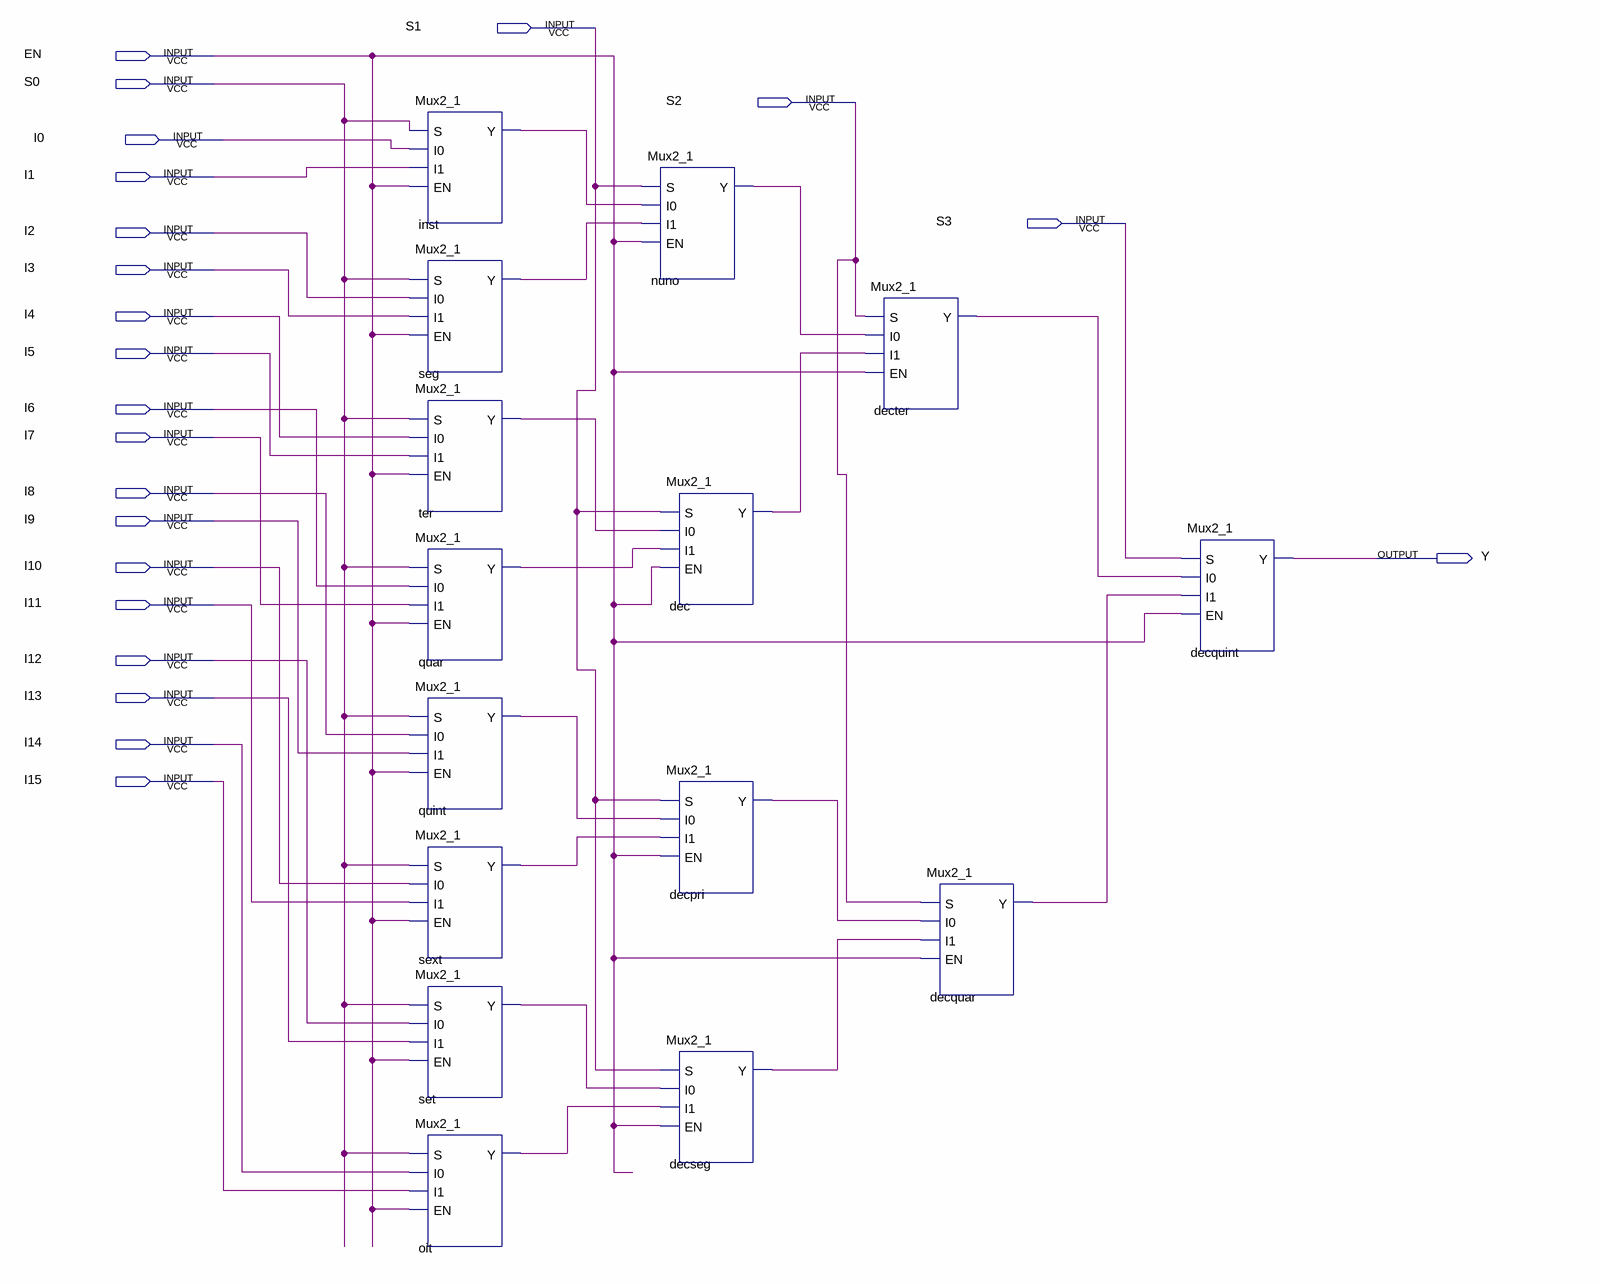
[diagram p0: schematic sheet]
// Quartus schematic Mux16_1.bdf as structural Verilog: 15 symbols, 22 pins
module Mux16_1 (
  input  S1,
  input  EN,
  input  S0,
  input  S2,
  input  I0,
  input  I1,
  input  S3,
  input  I2,
  input  I3,
  input  I4,
  input  I5,
  input  I6,
  input  I7,
  input  I8,
  input  I9,
  input  I10,
  input  I11,
  input  I12,
  input  I13,
  input  I14,
  input  I15,
  output Y
);

  wire dec_y, decpri_y, decquar_y, decseg_y, decter_y, inst_y, nuno_y, oit_y, quar_y, quint_y, seg_y, set_y,
       sext_y, ter_y;

  Mux2_1 inst (.S(S0), .I0(I0), .I1(I1), .EN(EN), .Y(inst_y));
  Mux2_1 seg (.S(S0), .I0(I2), .I1(I3), .EN(EN), .Y(seg_y));
  Mux2_1 ter (.S(S0), .I0(I4), .I1(I5), .EN(EN), .Y(ter_y));
  Mux2_1 quar (.S(S0), .I0(I6), .I1(I7), .EN(EN), .Y(quar_y));
  Mux2_1 quint (.S(S0), .I0(I8), .I1(I9), .EN(EN), .Y(quint_y));
  Mux2_1 sext (.S(S0), .I0(I10), .I1(I11), .EN(EN), .Y(sext_y));
  Mux2_1 set (.S(S0), .I0(I12), .I1(I13), .EN(EN), .Y(set_y));
  Mux2_1 oit (.S(S0), .I0(I14), .I1(I15), .EN(EN), .Y(oit_y));
  Mux2_1 nuno (.S(S1), .I0(inst_y), .I1(seg_y), .EN(EN), .Y(nuno_y));
  Mux2_1 dec (.S(S1), .I0(ter_y), .I1(quar_y), .EN(EN), .Y(dec_y));
  Mux2_1 decpri (.S(S1), .I0(quint_y), .I1(sext_y), .EN(EN), .Y(decpri_y));
  Mux2_1 decseg (.S(S1), .I0(set_y), .I1(oit_y), .EN(EN), .Y(decseg_y));
  Mux2_1 decter (.S(S2), .I0(nuno_y), .I1(dec_y), .EN(EN), .Y(decter_y));
  Mux2_1 decquar (.S(S2), .I0(decpri_y), .I1(decseg_y), .EN(EN), .Y(decquar_y));
  Mux2_1 decquint (.S(S3), .I0(decter_y), .I1(decquar_y), .EN(EN), .Y(Y));
endmodule
